# Altium project 基于蓝牙的单片机控制系统.PrjPCB
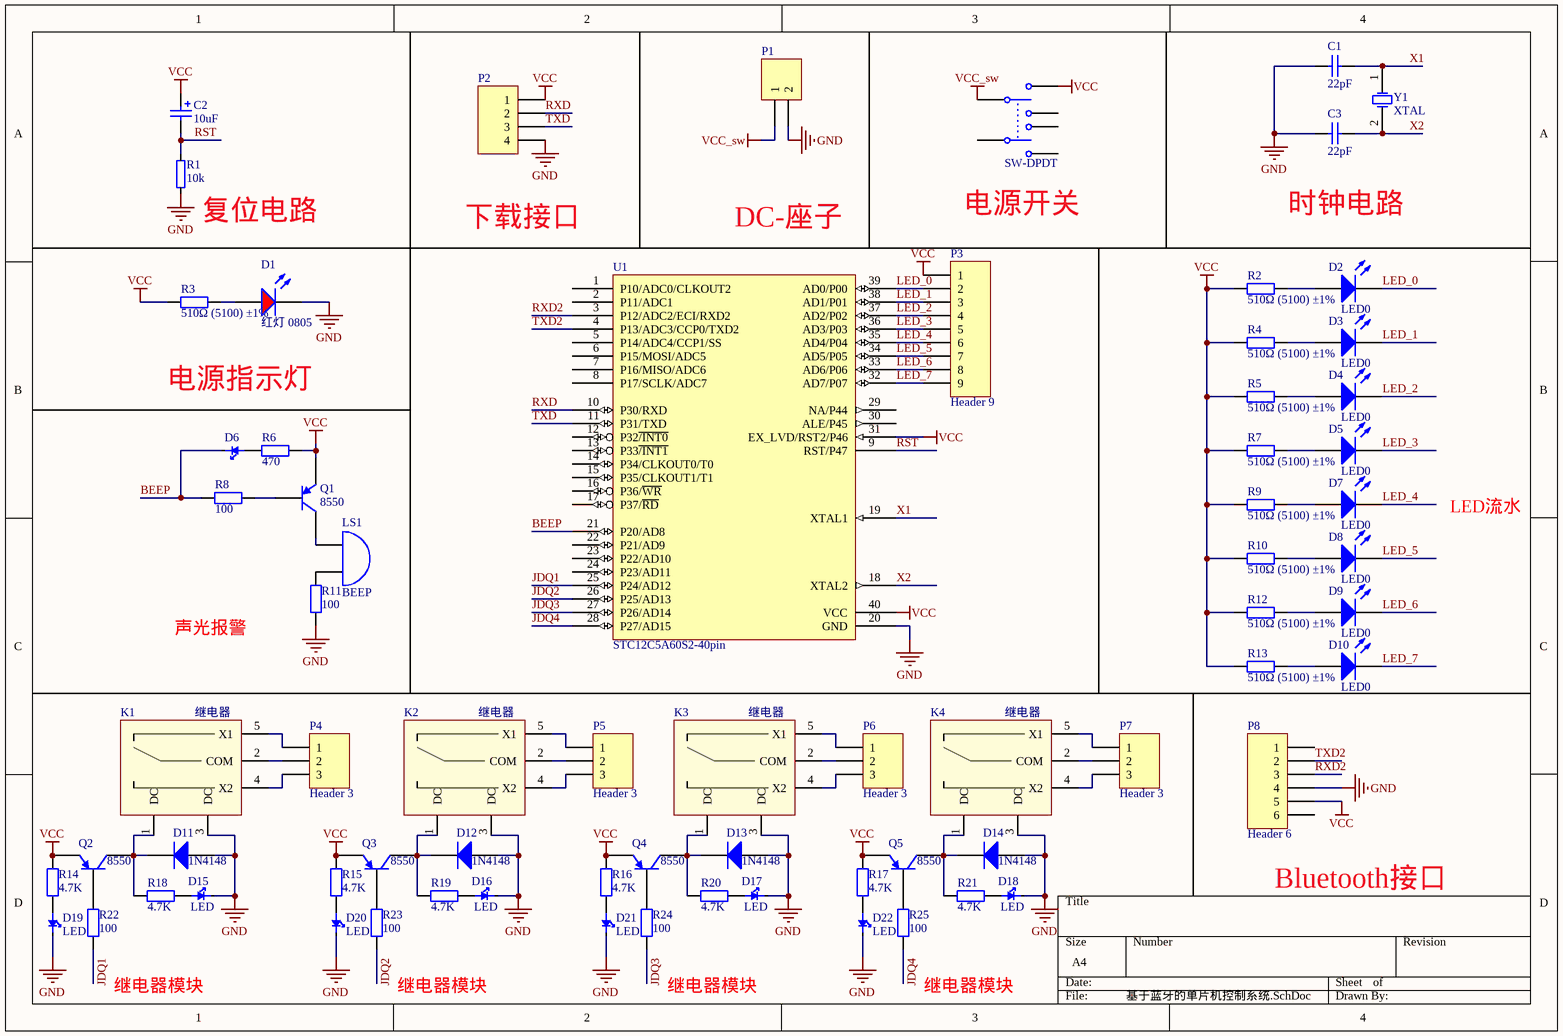
[diagram p0: 基于蓝牙的单片机控制系统.SchDoc]
1 sheet, 71 parts. Net scope: global (net labels, ports and power ports of the same name join across sheets).
Board file: 基于蓝牙的单片机控制系统.PcbDoc

## Sheet 基于蓝牙的单片机控制系统.SchDoc
size A4

### Parts
C1  value 22pF  [0805]  (hidden comment: Cap)
C2  10uF  [RB.2/.5mm]
C3  value 22pF  [0805]  (hidden comment: Cap)
D1  红灯 0805  [LC-0805_LED_S1]
D2  LED0  [HDR1X2]
D3  LED0  [HDR1X2]
D4  LED0  [HDR1X2]
D5  LED0  [HDR1X2]
D6  W  [LC-0805_LED_S1]  (value not drawn)
D7  LED0  [HDR1X2]
D8  LED0  [HDR1X2]
D9  LED0  [HDR1X2]
D10  LED0  [HDR1X2]
D11  1N4148  [SMA(DO-214AC)_S5]
D12  1N4148  [SMA(DO-214AC)_S5]
D13  1N4148  [SMA(DO-214AC)_S5]
D14  1N4148  [SMA(DO-214AC)_S5]
D15  LED  [LC-0805_LED_S1]
D16  LED  [LC-0805_LED_S1]
D17  LED  [LC-0805_LED_S1]
D18  LED  [LC-0805_LED_S1]
D19  LED  [LC-0805_LED_S1]
D20  LED  [LC-0805_LED_S1]
D21  LED  [LC-0805_LED_S1]
D22  LED  [LC-0805_LED_S1]
K1  继电器  [继电器5PIN_切换]
K2  继电器  [继电器5PIN_切换]
K3  继电器  [继电器5PIN_切换]
K4  继电器  [继电器5PIN_切换]
LS1  BEEP  [PIN2]
P1  电源  [DC插座]  (value not drawn)
P2  下载口  [HDR1X4]  (value not drawn)
P3  Header 9  [HDR1X9]
P4  Header 3  [KF128-5_3]
P5  Header 3  [KF128-5_3]
P6  Header 3  [KF128-5_3]
P7  Header 3  [KF128-5_3]
P8  Header 6  [HDR1X6]
Q1  8550  [SOT-23 MOS]
Q2  8550  [SOT-23 MOS]
Q3  8550  [SOT-23 MOS]
Q4  8550  [SOT-23 MOS]
Q5  8550  [SOT-23 MOS]
R1  10k  [0805]
R2  510Ω (5100) ±1%  [LC-0805_R]
R3  510Ω (5100) ±1%  [LC-0805_R]
R4  510Ω (5100) ±1%  [LC-0805_R]
R5  510Ω (5100) ±1%  [LC-0805_R]
R6  value 470  [0805]  (hidden comment: Res2)
R7  510Ω (5100) ±1%  [LC-0805_R]
R8  value 100  [0805]  (hidden comment: Res2)
R9  510Ω (5100) ±1%  [LC-0805_R]
R10  510Ω (5100) ±1%  [LC-0805_R]
R11  value 100  [0805]  (hidden comment: Res2)
R12  510Ω (5100) ±1%  [LC-0805_R]
R13  510Ω (5100) ±1%  [LC-0805_R]
R14  4.7K  [0805]
R15  4.7K  [0805]
R16  4.7K  [0805]
R17  4.7K  [0805]
R18  4.7K  [0805]
R19  4.7K  [0805]
R20  4.7K  [0805]
R21  4.7K  [0805]
R22  100  [0805]
R23  100  [0805]
R24  100  [0805]
R25  100  [0805]
U1  STC12C5A60S2-40pin  [DIP40]
Y1  XTAL  [XTAL]
常按开关1  SW-DPDT  [DPDT-6]

### Nets
GND: C1.1 C3.1 D1.K D11.1(A) D12.1(A) D13.1(A) D14.1(A) D15.K D16.K D17.K D18.K D19.K D20.K D21.K D22.K K1.3(DC) K2.3(DC) K3.3(DC) K4.3(DC) P1.2 P2.4 P8.4 R1.1 R11.1 U1.20(GND)
VCC: C2.1 P2.1 P3.1 P8.5 Q1.1(E) Q2.1(E) Q3.1(E) Q4.1(E) Q5.1(E) R2.1 R3.1 R4.1 R5.1 R6.1 R7.1 R9.1 R10.1 R12.1 R13.1 R14.1 R15.1 R16.1 R17.1 U1.31(EX_LVD/RST2/P46) U1.40(VCC) 常按开关1.2
VCC_sw: P1.1 常按开关1.1
BEEP: D6.K R8.2 U1.21(P20/AD8)
JDQ1: R22.1 U1.25(P24/AD12)
JDQ2: R23.1 U1.26(P25/AD13)
JDQ3: R24.1 U1.27(P26/AD14)
JDQ4: R25.1 U1.28(P27/AD15)
LED_0: D2.2(K) P3.2 U1.39(AD0/P00)
LED_1: D3.2(K) P3.3 U1.38(AD1/P01)
LED_2: D4.2(K) P3.4 U1.37(AD2/P02)
LED_3: D5.2(K) P3.5 U1.36(AD3/P03)
LED_4: D7.2(K) P3.6 U1.35(AD4/P04)
LED_5: D8.2(K) P3.7 U1.34(AD5/P05)
LED_6: D9.2(K) P3.8 U1.33(AD6/P06)
LED_7: D10.2(K) P3.9 U1.32(AD7/P07)
RST: C2.2 R1.2 U1.9(RST/P47)
RXD: P2.2 U1.10(P30/RXD)
RXD2: P8.3 U1.3(P12/ADC2/ECI/RXD2)
TXD: P2.3 U1.11(P31/TXD)
TXD2: P8.2 U1.4(P13/ADC3/CCP0/TXD2)
X1: C1.2 U1.19(XTAL1) Y1.1(OSC1)
X2: C3.2 U1.18(XTAL2) Y1.2(OSC2)
NetD1_A: D1.A R3.2
NetD2_1: D2.1(A) R2.2
NetD3_1: D3.1(A) R4.2
NetD4_1: D4.1(A) R5.2
NetD5_1: D5.1(A) R7.2
NetD6_A: D6.A R6.2
NetD7_1: D7.1(A) R9.2
NetD8_1: D8.1(A) R10.2
NetD9_1: D9.1(A) R12.2
NetD10_1: D10.1(A) R13.2
NetD11_2: D11.2(K) K1.1(DC) Q2.3(C) R18.2
NetD12_2: D12.2(K) K2.1(DC) Q3.3(C) R19.2
NetD13_2: D13.2(K) K3.1(DC) Q4.3(C) R20.2
NetD14_2: D14.2(K) K4.1(DC) Q5.3(C) R21.2
NetD15_A: D15.A R18.1
NetD16_A: D16.A R19.1
NetD17_A: D17.A R20.1
NetD18_A: D18.A R21.1
NetD19_A: D19.A R14.2
NetD20_A: D20.A R15.2
NetD21_A: D21.A R16.2
NetD22_A: D22.A R17.2
NetK1_2: K1.2(COM) P4.2
NetK1_4: K1.4(X2) P4.3
NetK1_5: K1.5(X1) P4.1
NetK2_2: K2.2(COM) P5.2
NetK2_4: K2.4(X2) P5.3
NetK2_5: K2.5(X1) P5.1
NetK3_2: K3.2(COM) P6.2
NetK3_4: K3.4(X2) P6.3
NetK3_5: K3.5(X1) P6.1
NetK4_2: K4.2(COM) P7.2
NetK4_4: K4.4(X2) P7.3
NetK4_5: K4.5(X1) P7.1
NetLS1_1: LS1.1(A) Q1.3(C)
NetLS1_2: LS1.2(B) R11.2
NetQ1_2: Q1.2(B) R8.1
NetQ2_2: Q2.2(B) R22.2
NetQ3_2: Q3.2(B) R23.2
NetQ4_2: Q4.2(B) R24.2
NetQ5_2: Q5.2(B) R25.2

Not connected (* = marked no-connect by the designer): P8 1 6; U1 1(P10/ADC0/CLKOUT2) 2(P11/ADC1) 5(P14/ADC4/CCP1/SS) 6(P15/MOSI/ADC5) 7(P16/MISO/ADC6) 8(P17/SCLK/ADC7) 12(P32~{/INT0}) 13(P33~{/INT1}) 14(P34/CLKOUT0/T0) 15(P35/CLKOUT1/T1) 16(P36/~{WR}) 17(P37/~{RD}) 22(P21/AD9) 23(P22/AD10) 24(P23/AD11) 29(NA/P44) 30(ALE/P45); 常按开关1 3 4 5 6

### Notes on the sheet
- (near R1) 复位电路
- 下载接口
- DC-座子
- 电源开关
- 时钟电路
- 电源指示灯
- LED流水
- 声光报警
- (near P8) Bluetooth接口
- (near R22) 继电器模块
- (near R23) 继电器模块
- (near R24) 继电器模块
- (near R25) 继电器模块

### Library data of the parts
C1 C3 = Cap: Capacitor; Published: 8-Jun-2000; LatestRevisionDate: 17-Jul-2002; LatestRevisionNote: Re-released for DXP Platform.; PackageReference: RAD-0.3; Publisher: Altium Limited; PackageDescription: Radial Cap, Thru-Hole; 2 Leads; 0.3 in Pin Spacing
C2 = Cap Pol2: Polarized Capacitor (Axial); Value: 100pF; Published: 8-Jun-2000; LatestRevisionDate: 17-Jul-2002; LatestRevisionNote: Re-released for DXP Platform.; PackageReference: POLAR0.8; Publisher: Altium Limited; PackageDescription: Polarized Capacitor; 2 Leads
D1 = 0805 红灯: 发光二极管; ComponentLink1Description: 供应商链接; ComponentLink1URL: http://www.szlcsc.com/product/details_2668.html; Package: 0805; Supplier: LC; SuppliersPartNumber: C2295
D2-D5 D7-D10 = LED0: Typical INFRARED GaAs LED; Published: 8-Jun-2000; LatestRevisionDate: 08-Jul-2005; LatestRevisionNote: Mech Layer 1 removed.; PackageReference: LED-0; Publisher: Altium Limited; PackageDescription: LED; 2 Leads
D6 = LED
D11-D14 = Diode 1N4148: High Conductance Fast Diode; Published: 8-Jun-2000; LatestRevisionDate: 17-Jul-2002; LatestRevisionNote: Re-released for DXP Platform.; DatasheetVersion: 1997; PackageReference: DO-35; Publisher: Altium Limited; PackageDescription: Diode, Axial; Body 3.8 x 1.9 mm (LxDia. max), Lead Dia. 0.53 mm (max); Code_JEDEC: DO-204-AH; ComponentLink1Description: Manufacturer Link; ComponentLink1URL: http://www.fairchildsemi.com/; ComponentLink2Description: Datasheet; ComponentLink2URL: http://www.fairchildsemi.com/ds/1N%2F1N4148.pdf
K1-K4 = 松乐继电器5V-5PIN
LS1 = Bell: Electrical Bell; Published: 24-Mar-1999; LatestRevisionDate: 17-Jul-2002; LatestRevisionNote: Re-released for DXP Platform.; PackageReference: PIN2; Publisher: Altium Limited
P1 = Header 2: Header, 2-Pin; LatestRevisionDate: 17-Jul-2002; LatestRevisionNote: Re-released for DXP Platform.; Publisher: Altium Limited
P2 = Header 4: Header, 4-Pin; LatestRevisionDate: 17-Jul-2002; LatestRevisionNote: Re-released for DXP Platform.; Publisher: Altium Limited
P3 = Header 9: Header, 9-Pin; LatestRevisionDate: 17-Jul-2002; LatestRevisionNote: Re-released for DXP Platform.; Publisher: Altium Limited
P4-P7 = Header 3: Header, 3-Pin; LatestRevisionDate: 17-Jul-2002; LatestRevisionNote: Re-released for DXP Platform.; Publisher: Altium Limited
P8 = Header 6: Header, 6-Pin; LatestRevisionDate: 17-Jul-2002; LatestRevisionNote: Re-released for DXP Platform.; Publisher: Altium Limited
Q1-Q5 = 2N3906: PNP General Purpose Amplifier; Published: 8-Jun-2000; LatestRevisionDate: 15-Jan-2003; LatestRevisionNote: PCB Footprint 'BCY-W3/D4.7' replaced; DatasheetVersion: 1997; PackageVersion: Sep-1998; PackageReference: TO-92A; Publisher: Altium Limited; PackageDescription: TO, Flat Index; 3 In-Line, Axial Leads; Body Dia. 4.5mm; Leads 0.51 x 0.48 mm (max); ComponentLink1Description: Manufacturer Link; ComponentLink1URL: http://www.fairchildsemi.com/; ComponentLink2Description: Datasheet; ComponentLink2URL: http://www.fairchildsemi.com/ds/2N%2F2N3906.pdf
R1 = RES5
R2-R5 R7 R9 R10 R12 R13 = 0805 510Ω (5100) 1%: 贴片电阻; ComponentLink1Description: 供应商链接; ComponentLink1URL: http://www.szlcsc.com/product/details_18422.html; Package: 0805; Supplier: LC; SuppliersPartNumber: C17734
R6 R8 R11 R14-R21 = Res2: Resistor; Published: 8-Jun-2000; LatestRevisionDate: 17-Jul-2002; LatestRevisionNote: Re-released for DXP Platform.; PackageReference: AXIAL-0.4; Publisher: Altium Limited; PackageDescription: Axial Device, Thru-Hole; 2 Leads; 0.4 in Pin Spacing
  R14-R21: Value: 4.7K
R22-R25 = Res2: Resistor; Value: 4.7K; Published: 8-Jun-2000; LatestRevisionDate: 17-Jul-2002; LatestRevisionNote: Re-released for DXP Platform.; PackageReference: AXIAL-0.4; Publisher: Altium Limited; PackageDescription: Axial Device, Thru-Hole; 2 Leads; 0.4 in Pin Spacing
Y1 = XTAL: Crystal Oscillator; Published: 8-Jun-2000; LatestRevisionDate: 17-Jul-2002; LatestRevisionNote: Re-released for DXP Platform.; PackageReference: R38; Publisher: Altium Limited; PackageDescription: Crystal, Thru-Hole; 2 Leads; Body 3.1 x 8.2 mm (Dia.xH)
常按开关1 = SW-DPDT: Double-Pole, Double-Throw Switch; Published: 24-Mar-1999; LatestRevisionDate: 17-Jul-2002; LatestRevisionNote: Re-released for DXP Platform.; PackageReference: DPDT-6; Publisher: Altium Limited; PackageDescription: Switch; 6 Leads